# Altium schematic sheet ECU_Sheet.SchDoc
size 420 x 297 mm; SheetNumber: 1; SheetTotal: 4
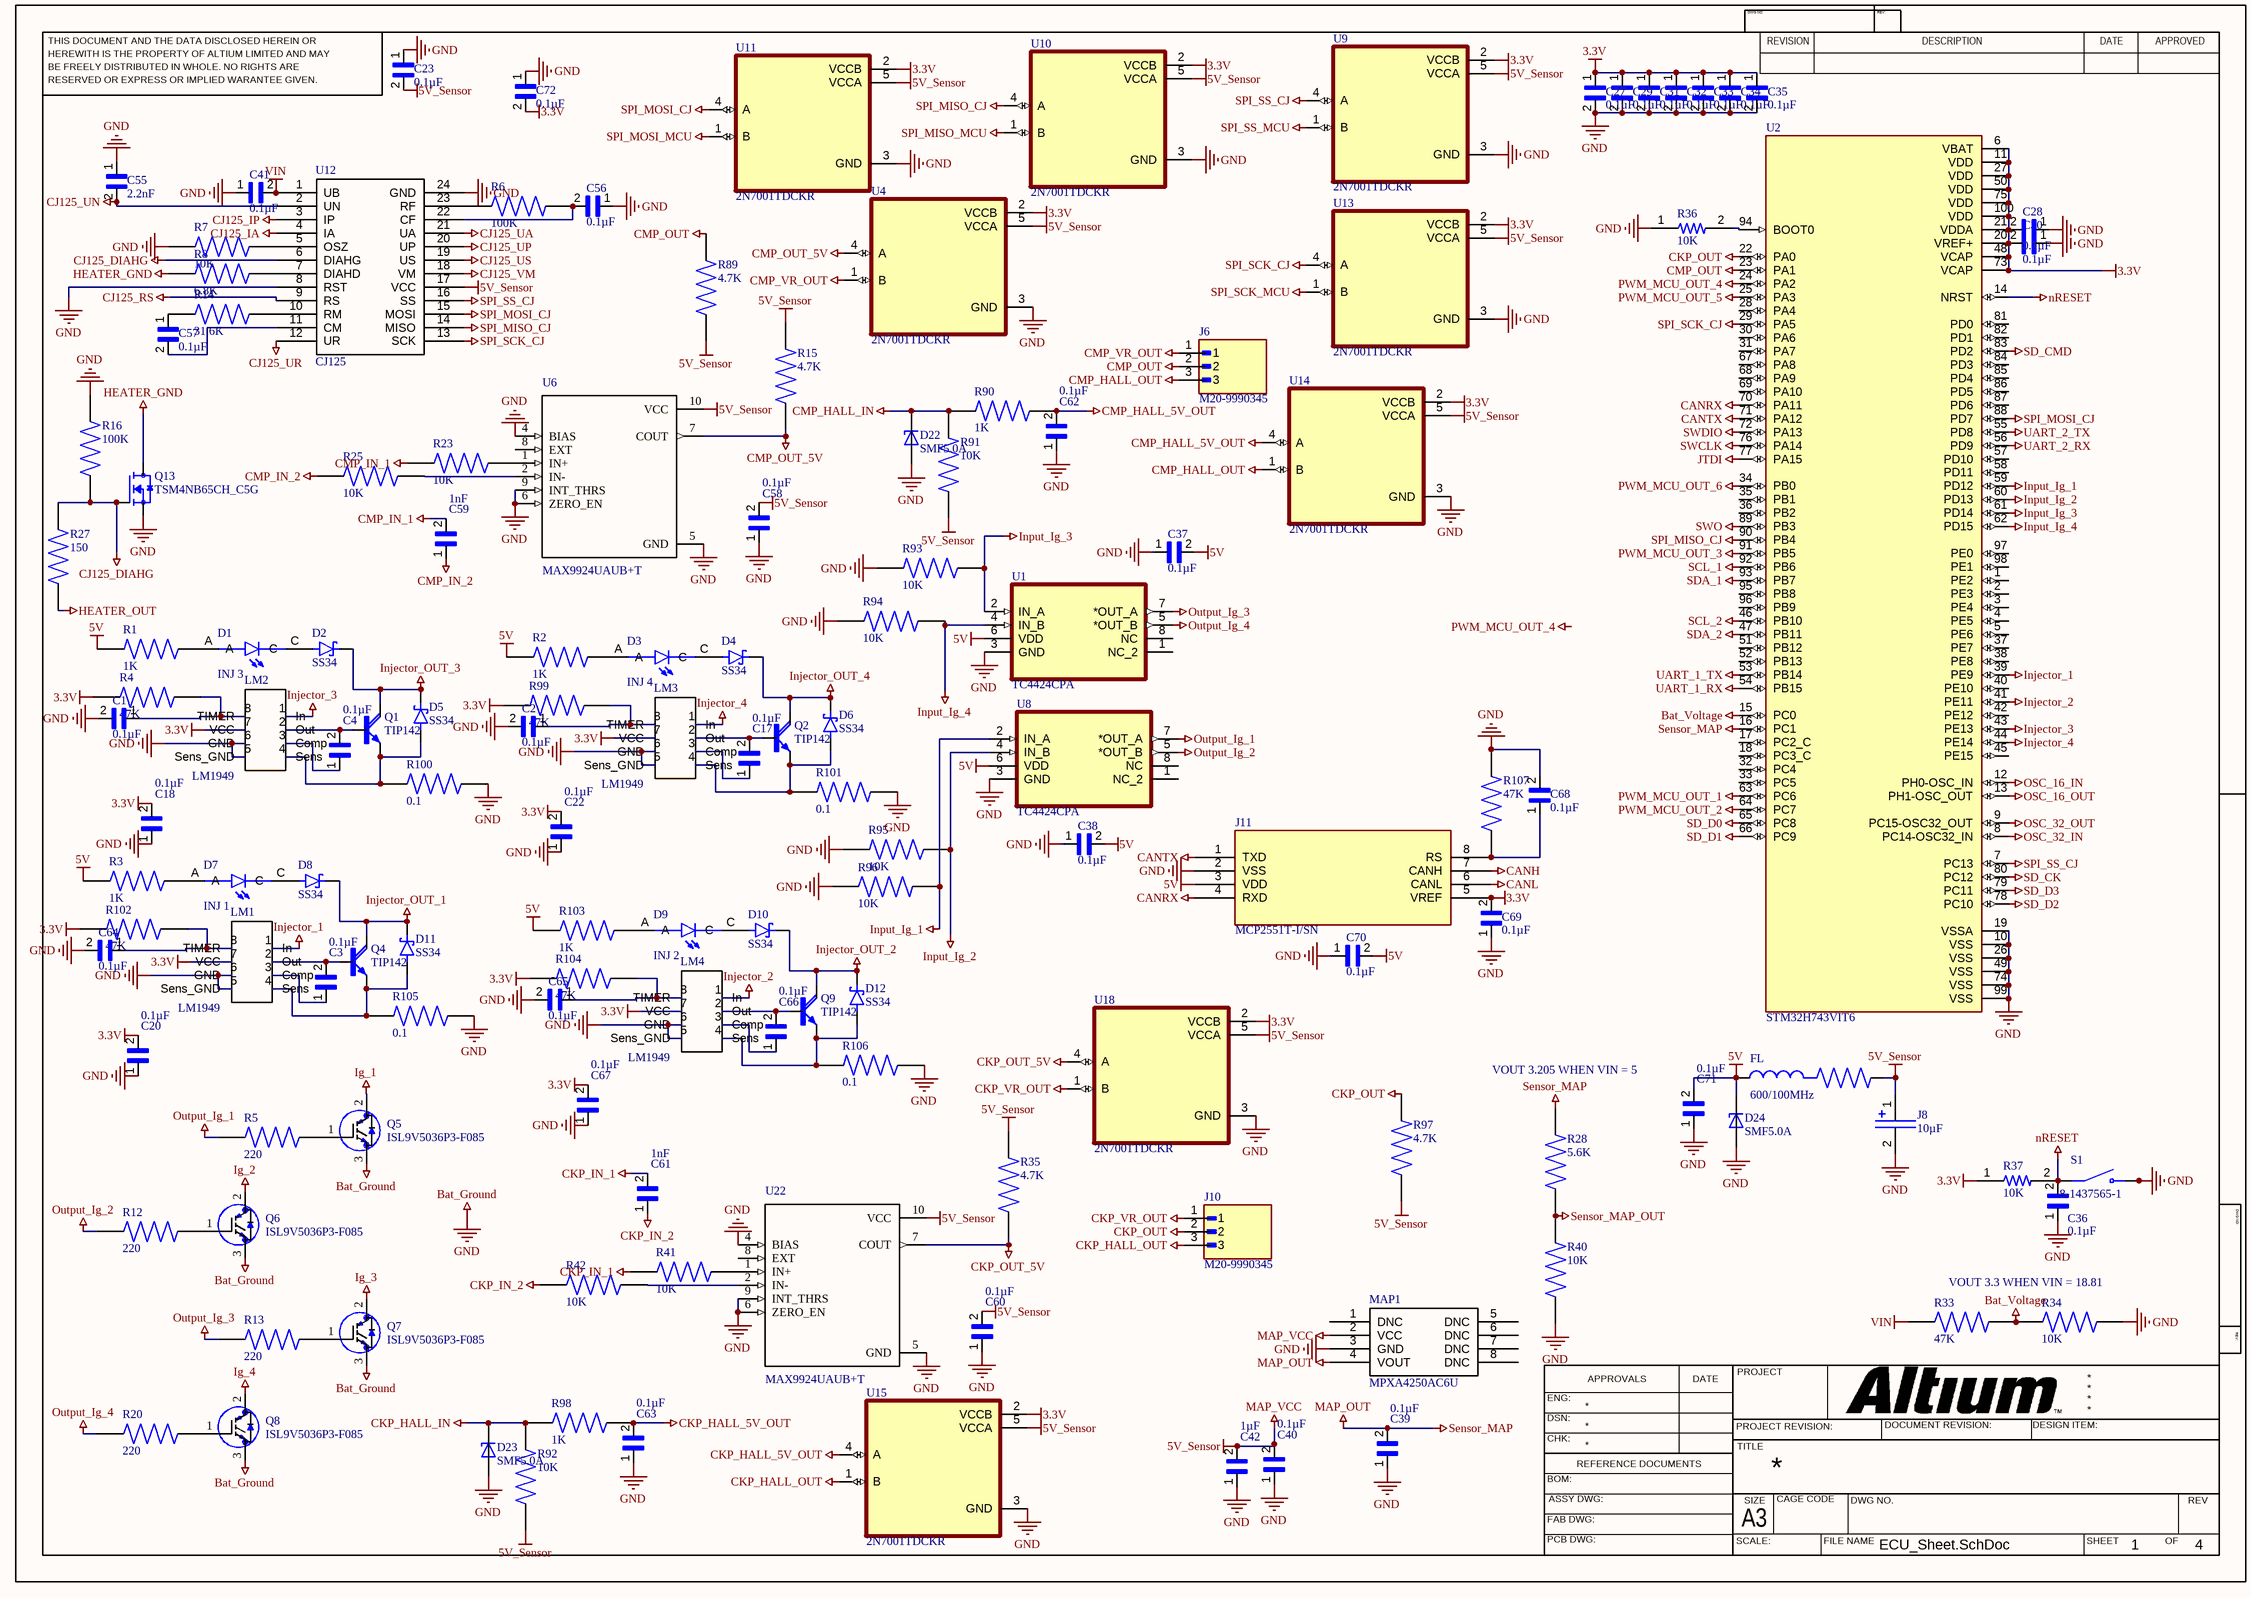
[diagram p0: ECU_Sheet.SchDoc]

## Parts
C1  0.1µF  [CAPC1608X90N]
C2  0.1µF  [CAPC1608X90N]
C3  0.1µF  [CAPC1608X90N]
C4  0.1µF  [CAPC1608X90N]
C17  0.1µF  [CAPC1608X90N]
C18  0.1µF  [CAPC1608X90N]
C20  0.1µF  [CAPC1608X90N]
C22  0.1µF  [CAPC1608X90N]
C23  0.1µF  [CAPC1608X90N]
C27  0.1µF  [CAPC1608X90N]
C28  0.1µF  [CAPC1608X90N]
C29  0.1µF  [CAPC1608X90N]
C30  0.1µF  [CAPC1608X90N]
C31  0.1µF  [CAPC1608X90N]
C32  0.1µF  [CAPC1608X90N]
C33  0.1µF  [CAPC1608X90N]
C34  0.1µF  [CAPC1608X90N]
C35  0.1µF  [CAPC1608X90N]
C36  0.1µF  [CAPC1608X90N]
C37  0.1µF  [CAPC1608X90N]
C38  0.1µF  [CAPC1608X90N]
C39  0.1µF  [CAPC1608X90N]
C40  0.1µF  [CAPC1608X90N]
C41  0.1µF  [CAPC1608X90N]
C42  1µF  [CAPC1608X90N]
C55  2.2nF  [CAPC1608X90N]
C56  0.1µF  [CAPC1608X90N]
C57  0.1µF  [CAPC1608X90N]
C58  0.1µF  [CAPC1608X90N]
C59  1nF  [CAPC1608X90N]
C60  0.1µF  [CAPC1608X90N]
C61  1nF  [CAPC1608X90N]
C62  0.1µF  [CAPC1608X90N]
C63  0.1µF  [CAPC1608X90N]
C64  0.1µF  [CAPC1608X90N]
C65  0.1µF  [CAPC1608X90N]
C66  0.1µF  [CAPC1608X90N]
C67  0.1µF  [CAPC1608X90N]
C68  0.1µF  [CAPC1608X90N]
C69  0.1µF  [CAPC1608X90N]
C70  0.1µF  [CAPC1608X90N]
C71  0.1µF  [CAPC1608X90N]
C72  0.1µF  [CAPC1608X90N]
D1  INJ 3  [LEDC2012X70N]
D2  SS34  [DIO_SS34]
D3  INJ 4  [LEDC2012X70N]
D4  SS34  [DIO_SS34]
D5  SS34  [DIO_SS34]
D6  SS34  [DIO_SS34]
D7  INJ 1  [LEDC2012X70N]
D8  SS34  [DIO_SS34]
D9  INJ 2  [LEDC2012X70N]
D10  SS34  [DIO_SS34]
D11  SS34  [DIO_SS34]
D12  SS34  [DIO_SS34]
D22  SMF5.0A  [SODFL3718X102N]
D23  SMF5.0A  [SODFL3718X102N]
D24  SMF5.0A  [SODFL3718X102N]
FL  600/100MHz  [BEADC1608X95N]
J6  M20-9990345  [HARWIN_M20-9990345]
J8  10µF  [T491A106K010AT]
J10  M20-9990345  [HARWIN_M20-9990345]
J11  MCP2551T-I/SN  [SOIC8-N_MC]
LM1  LM1949  [DIP794W45P254L959H508Q8]
LM2  LM1949  [DIP794W45P254L959H508Q8]
LM3  LM1949  [DIP794W45P254L959H508Q8]
LM4  LM1949  [DIP794W45P254L959H508Q8]
MAP1  MPXA4250AC6U  [SOIC127P1041X990-8N]
Q1  TIP142  [SOT93]
Q2  TIP142  [SOT93]
Q4  TIP142  [SOT93]
Q5  ISL9V5036P3-F085  [*TO254P470X1016X2019-3P]
Q6  ISL9V5036P3-F085  [*TO254P470X1016X2019-3P]
Q7  ISL9V5036P3-F085  [*TO254P470X1016X2019-3P]
Q8  ISL9V5036P3-F085  [*TO254P470X1016X2019-3P]
Q9  TIP142  [SOT93]
Q13  TSM4NB65CH_C5G  [TO228P680X240X837-3]
R1  1K  [RESC3116X65N]
R2  1K  [RESC3116X65N]
R3  1K  [RESC3116X65N]
R4  47K  [RESC3116X65N]
R5  220  [RES_ERJP08J221V]
R6  100K  [RESC3116X65N]
R7  10K  [RESC3116X65N]
R8  6.8K  [RESC3116X65N]
R12  220  [RES_ERJP08J221V]
R13  220  [RES_ERJP08J221V]
R14  31.6K  [RESC3116X65N]
R15  4.7K  [RESC3116X65N]
R16  100K  [RESC3116X65N]
R20  220  [RES_ERJP08J221V]
R23  10K  [RESC3116X65N]
R25  10K  [RESC3116X65N]
R27  150  [RESC3116X65N]
R28  5.6K  [RESC3116X65N]
R33  47K  [RESC3116X65N]
R34  10K  [RESC3116X65N]
R35  4.7K  [RESC3116X65N]
R36  10K  [RESC1608X50N]
R37  10K  [RESC1608X50N]
R40  10K  [RESC3116X65N]
R41  10K  [RESC3116X65N]
R42  10K  [RESC3116X65N]
R89  4.7K  [RESC3116X65N]
R90  1K  [RESC3116X65N]
R91  10K  [RESC3116X65N]
R92  10K  [RESC3116X65N]
R93  10K  [RESC3116X65N]
R94  10K  [RESC3116X65N]
R95  10K  [RESC3116X65N]
R96  10K  [RESC3116X65N]
R97  4.7K  [RESC3116X65N]
R98  1K  [RESC3116X65N]
R99  47K  [RESC3116X65N]
R100  0.1  [RES_ERJ6RSFR10V]
R101  0.1  [RES_ERJ6RSFR10V]
R102  47K  [RESC3116X65N]
R103  1K  [RESC3116X65N]
R104  47K  [RESC3116X65N]
R105  0.1  [RES_ERJ6RSFR10V]
R106  0.1  [RES_ERJ6RSFR10V]
R107  47K  [RESC3116X65N]
S1  8-1437565-1  [SW_8-1437565-1]
U1  TC4424CPA  [DIP254P762X432-8]
U2  STM32H743VIT6  [QFP50P1600X1600X160-100N]
U4  2N7001TDCKR  [SOT65P210X110-5N]
U6  MAX9924UAUB+T  [*SOP50P490X110-10N]
U8  TC4424CPA  [DIP254P762X432-8]
U9  2N7001TDCKR  [SOT65P210X110-5N]
U10  2N7001TDCKR  [SOT65P210X110-5N]
U11  2N7001TDCKR  [SOT65P210X110-5N]
U12  CJ125  [CJ125]
U13  2N7001TDCKR  [SOT65P210X110-5N]
U14  2N7001TDCKR  [SOT65P210X110-5N]
U15  2N7001TDCKR  [SOT65P210X110-5N]
U18  2N7001TDCKR  [SOT65P210X110-5N]
U22  MAX9924UAUB+T  [*SOP50P490X110-10N]

## Nets
3.3V: C18.2 C20.2 C22.2 C27.1 C28.2 C29.1 C30.2 C31.1 C32.1 C33.1 C34.1 C35.1 C67.2 C69.2 C72.2 J11.5(VREF) LM1.7(VCC) LM2.7(VCC) LM3.7(VCC) LM4.7(VCC) R4.1 R37.1 R99.1 R102.1 R104.1 U2.6(VBAT) U2.11(VDD) U2.20(VREF+) U2.21(VDDA) U2.27(VDD) U2.48(VCAP) U2.50(VDD) U2.73(VCAP) U2.75(VDD) U2.100(VDD) U4.2(VCCB) U9.2(VCCB) U10.2(VCCB) U11.2(VCCB) U13.2(VCCB) U14.2(VCCB) U15.2(VCCB) U18.2(VCCB)
5V: C37.2 C38.2 C70.2 C71.2 D24.C FL.1 J11.3(VDD) R1.1 R2.1 R3.1 R103.1 U1.6(VDD) U8.6(VDD)
5V_Sensor: C23.2 C40.2 C42.2 C58.2 C60.2 FL.2 J8.1(P$1) MAP1.2(VCC) R15.2 R35.2 R89.1 R91.1 R92.1 R97.1 U4.5(VCCA) U6.10(VCC) U9.5(VCCA) U10.5(VCCA) U11.5(VCCA) U12.17(VCC) U13.5(VCCA) U14.5(VCCA) U15.5(VCCA) U18.5(VCCA) U22.10(VCC)  [also labelled MAP_VCC]
Bat_Ground: C1.2 C2.2 C18.1 C20.1 C22.1 C23.1 C27.2 C28.1 C29.2 C30.1 C31.2 C32.2 C33.2 C34.2 C35.2 C36.1 C37.1 C38.1 C39.1 C40.1 C41.1 C42.1 C55.1 C56.1 C58.1 C60.1 C62.1 C63.1 C64.2 C65.2 C67.1 C68.2 C69.1 C70.1 C71.1 C72.1 D22.A D23.A D24.A J8.2(P$2) J11.2(VSS) LM1.5(Sens_GND) LM1.6(GND) LM2.5(Sens_GND) LM2.6(GND) LM3.5(Sens_GND) LM3.6(GND) LM4.5(Sens_GND) LM4.6(GND) MAP1.3(GND) Q5.3(E) Q6.3(E) Q7.3(E) Q8.3(E) Q13.3(S) R7.1 R16.2 R34.2 R36.1 R40.1 R93.1 R94.1 R95.1 R96.1 R100.2 R101.2 R105.2 R106.2 R107.2 S1.3(NO) S1.4(NO) U1.3(GND) U2.10(VSS) U2.19(VSSA) U2.26(VSS) U2.49(VSS) U2.74(VSS) U2.99(VSS) U4.3(GND) U6.4(BIAS) U6.5(GND) U6.6(ZERO_EN) U6.9(INT_THRS) U8.3(GND) U9.3(GND) U10.3(GND) U11.3(GND) U12.8(RST) U12.24(GND) U13.3(GND) U14.3(GND) U15.3(GND) U18.3(GND) U22.4(BIAS) U22.5(GND) U22.6(ZERO_EN) U22.9(INT_THRS)  [also labelled GND]
Bat_Voltage: R33.2 R34.1 U2.15(PC0)
CANH: J11.7(CANH)
CANL: J11.6(CANL)
CANRX: J11.4(RXD) U2.70(PA11)
CANTX: J11.1(TXD) U2.71(PA12)
CJ125_DIAHG: Q13.1(G) R16.1 R27.2 U12.6(DIAHG)
CJ125_IA: U12.4(IA)
CJ125_IP: U12.3(IP)
CJ125_RS: U12.9(RS)
CJ125_UA: U12.21(UA)
CJ125_UN: C55.2 U12.2(UN)
CJ125_UP: U12.20(UP)
CJ125_UR: U12.12(UR)
CJ125_US: U12.19(US)
CJ125_VM: U12.18(VM)
CKP_HALL_5V_OUT: C63.2 R98.1 U15.4(A)
CKP_HALL_IN: D23.C R92.2 R98.2
CKP_HALL_OUT: J10.3 U15.1(B)
CKP_IN_1: C61.2 R41.1
CKP_IN_2: C61.1 R42.1
CKP_OUT: J10.2 R97.2 U2.22(PA0)
CKP_OUT_5V: R35.1 U18.4(A) U22.7(COUT)
CKP_VR_OUT: J10.1 U18.1(B)
CMP_HALL_5V_OUT: C62.2 R90.1 U14.4(A)
CMP_HALL_IN: D22.C R90.2 R91.2
CMP_HALL_OUT: J6.3 U14.1(B)
CMP_IN_1: C59.2 R23.1
CMP_IN_2: C59.1 R25.1
CMP_OUT: J6.2 R89.2 U2.23(PA1)
CMP_OUT_5V: R15.1 U4.4(A) U6.7(COUT)
CMP_VR_OUT: J6.1 U4.1(B)
HEATER_GND: Q13.2(D) R8.1
HEATER_OUT: R27.1
Ig_1: Q5.2(C)
Ig_2: Q6.2(C)
Ig_3: Q7.2(C)
Ig_4: Q8.2(C)
Injector_1: LM1.1(In) U2.39(PE9)
Injector_2: LM4.1(In) U2.41(PE11)
Injector_3: LM2.1(In) U2.43(PE13)
Injector_4: LM3.1(In) U2.44(PE14)
Injector_OUT_1: D8.C(K) D11.C(K) Q4.C
Injector_OUT_2: D10.C(K) D12.C(K) Q9.C
Injector_OUT_3: D2.C(K) D5.C(K) Q1.C
Injector_OUT_4: D4.C(K) D6.C(K) Q2.C
Input_Ig_1: R96.2 U2.59(PD12) U8.2(IN_A)
Input_Ig_2: R95.2 U2.60(PD13) U8.4(IN_B)
Input_Ig_3: R93.2 U1.2(IN_A) U2.61(PD14)
Input_Ig_4: R94.2 U1.4(IN_B) U2.62(PD15)
JTDI: U2.77(PA15)
MAP_OUT: C39.2 MAP1.4(VOUT) R28.1 U2.16(PC1)  [also labelled Sensor_MAP]
nRESET: C36.2 R37.2 S1.1(COM) S1.2(COM) U2.14(NRST)
OSC_16_IN: U2.12(PH0-OSC_IN)
OSC_16_OUT: U2.13(PH1-OSC_OUT)
OSC_32_IN: U2.8(PC14-OSC32_IN)
OSC_32_OUT: U2.9(PC15-OSC32_OUT)
Output_Ig_1: R5.1 U8.7(*OUT_A)
Output_Ig_2: R12.1 U8.5(*OUT_B)
Output_Ig_3: R13.1 U1.7(*OUT_A)
Output_Ig_4: R20.1 U1.5(*OUT_B)
PWM_MCU_OUT_1: U2.63(PC6)
PWM_MCU_OUT_2: U2.64(PC7)
PWM_MCU_OUT_3: U2.91(PB5)
PWM_MCU_OUT_4: U2.24(PA2)
PWM_MCU_OUT_5: U2.25(PA3)
PWM_MCU_OUT_6: U2.34(PB0)
SCL_1: U2.92(PB6)
SCL_2: U2.46(PB10)
SD_CK: U2.80(PC12)
SD_CMD: U2.83(PD2)
SD_D0: U2.65(PC8)
SD_D1: U2.66(PC9)
SD_D2: U2.78(PC10)
SD_D3: U2.79(PC11)
SDA_1: U2.93(PB7)
SDA_2: U2.47(PB11)
Sensor_MAP_OUT: R28.2 R40.2
SPI_MISO_CJ: U2.90(PB4) U10.4(A) U12.14(MISO)
SPI_MISO_MCU: U10.1(B)
SPI_MOSI_CJ: U2.88(PD7) U11.4(A) U12.15(MOSI)
SPI_MOSI_MCU: U11.1(B)
SPI_SCK_CJ: U2.29(PA5) U12.13(SCK) U13.4(A)
SPI_SCK_MCU: U13.1(B)
SPI_SS_CJ: U2.7(PC13) U9.4(A) U12.16(SS)
SPI_SS_MCU: U9.1(B)
SWCLK: U2.76(PA14)
SWDIO: U2.72(PA13)
SWO: U2.89(PB3)
UART_1_RX: U2.54(PB15)
UART_1_TX: U2.53(PB14)
UART_2_RX: U2.56(PD9)
UART_2_TX: U2.55(PD8)
VIN: C41.2 R33.1 U12.1(UB)
NetC1_1: C1.1 LM2.8(TIMER) R4.2
NetC2_1: C2.1 LM3.8(TIMER) R99.2
NetC3_1: C3.1 LM1.3(Comp)
NetC3_2: C3.2 LM1.2(Out) Q4.B
NetC4_1: C4.1 LM2.3(Comp)
NetC4_2: C4.2 LM2.2(Out) Q1.B
NetC17_1: C17.1 LM3.3(Comp)
NetC17_2: C17.2 LM3.2(Out) Q2.B
NetC56_2: C56.2 R6.2 U12.22(CF)
NetC57_1: C57.1 R14.1
NetC57_2: C57.2 U12.11(CM)
NetC64_1: C64.1 LM1.8(TIMER) R102.2
NetC65_1: C65.1 LM4.8(TIMER) R104.2
NetC66_1: C66.1 LM4.3(Comp)
NetC66_2: C66.2 LM4.2(Out) Q9.B
NetC68_1: C68.1 J11.8(RS) R107.1
NetD1_A: D1.A R1.2
NetD1_C: D1.C D2.A
NetD3_A: D3.A R2.2
NetD3_C: D3.C D4.A
NetD5_A: D5.A LM2.4(Sens) Q1.E R100.1
NetD6_A: D6.A LM3.4(Sens) Q2.E R101.1
NetD7_A: D7.A R3.2
NetD7_C: D7.C D8.A
NetD9_A: D9.A R103.2
NetD9_C: D9.C D10.A
NetD11_A: D11.A LM1.4(Sens) Q4.E R105.1
NetD12_A: D12.A LM4.4(Sens) Q9.E R106.1
NetQ5_1: Q5.1(G) R5.2
NetQ6_1: Q6.1(G) R12.2
NetQ7_1: Q7.1(G) R13.2
NetQ8_1: Q8.1(G) R20.2
NetR6_1: R6.1 U12.23(RF)
NetR7_2: R7.2 U12.5(OSZ)
NetR8_2: R8.2 U12.7(DIAHD)
NetR14_2: R14.2 U12.10(RM)
NetR23_2: R23.2 U6.1(IN+)
NetR25_2: R25.2 U6.2(IN-)
NetR36_2: R36.2 U2.94(BOOT0)
NetR41_2: R41.2 U22.1(IN+)
NetR42_2: R42.2 U22.2(IN-)

Not connected (* = marked no-connect by the designer): MAP1 1(DNC) 5(DNC) 6(DNC) 7(DNC) 8(DNC); U1 1(NC_2) 8(NC); U2 1(PE2) 2(PE3) 3(PE4) 4(PE5) 5(PE6) 17(PC2_C) 18(PC3_C) 28(PA4) 30(PA6) 31(PA7) 32(PC4) 33(PC5) 35(PB1) 36(PB2) 37(PE7) 38(PE8) 40(PE10) 42(PE12) 45(PE15) 51(PB12) 52(PB13) 57(PD10) 58(PD11) 67(PA8) 68(PA9) 69(PA10) 81(PD0) 82(PD1) 84(PD3) 85(PD4) 86(PD5) 87(PD6) 95(PB8) 96(PB9) 97(PE0) 98(PE1); U6 8(EXT); U8 1(NC_2) 8(NC); U22 8(EXT)

## Notes on the sheet
- VOUT 3.205 WHEN VIN = 5
- VOUT 3.3 WHEN VIN = 18.81
- Labels drawn without touching a wire or pin: PWM_MCU_OUT_4
- THIS DOCUMENT AND THE DATA DISCLOSED HEREIN OR
- HEREWITH IS THE PROPERTY OF ALTIUM LIMITED AND MAY
- DWG NO:
- REVISION
- REV:
- DESCRIPTION
- DATE
- APPROVED
- BE FREELY DISTRIBUTED IN WHOLE. NO RIGHTS ARE
- RESERVED OR EXPRESS OR IMPLIED WARANTEE GIVEN.
- ENG:
- APPROVALS
- PROJECT
- DSN:
- CHK:
- REFERENCE DOCUMENTS
- PROJECT REVISION:
- TITLE
- DOCUMENT REVISION:
- DESIGN ITEM:
- BOM:
- FAB DWG:
- PCB DWG:
- ASSY DWG:
- SCALE:
- A3
- SIZE
- CAGE CODE
- FILE NAME
- DWG NO.
- SHEET
- OF
- REV

## Library data of the parts
C1-C4 C17 C18 C20 C22 C23 C27-C42 C55-C72 = 06035C104MAZ2A: Multilayer Ceramic Capacitors MLCC - SMD/SMT; Package: None; Price: None; Value: *; MP: 06035C104MAZ2A; Availability: Unavailable
D1 D3 D7 D9 = 597-3305-607F: LED Uni-Color Green 4-Pin Chip 0805 T/R; Availability: Unavailable; Value: *; Price: None; MP: 597-3305-607F; Package: None
D2 D4-D6 D8 D10-D12 = SS34: 3A, 40V, Schottky Rectifier; MF: Taiwan Semiconductor; SnapEDA_Link: https://www.snapeda.com/parts/SS34/Taiwan+Semiconductor/view-part/?ref=snap; Package: DO-214AB-2 Taiwan Semiconductor; Value: *; MP: SS34; Check_prices: https://www.snapeda.com/parts/SS34/Taiwan+Semiconductor/view-part/?ref=eda
D22-D24 = SMF5.0A: 200W, 6.7V, 5%, Unidirectional, TVS; MF: Taiwan Semiconductor; SnapEDA_Link: https://www.snapeda.com/parts/SMF5.0A/taiwan/view-part/?ref=snap; Package: SOD-123W-2 Taiwan Semiconductor; Value: *; MP: SMF5.0A; Check_prices: https://www.snapeda.com/parts/SMF5.0A/taiwan/view-part/?ref=eda
FL = BLM18DN601SZ1D: 600 Ohms @ 100MHz 1 Ferrite Bead 0603 _1608 Metric_ 700mA; MF: Murata; Package: 1608 Murata; Availability: Unavailable; Value: *; MP: BLM18DN601SZ1D; SnapEDA_Link: https://www.snapeda.com/parts/BLM18DN601SZ1D/Murata/view-part/4302620/?ref=snap; Price: None
J6 J10 = M20-9990345: 2.54mm (0.1) Pitch SIL Vertical Throughboard Pin Header, 6.1mm mating pin height, gold (hi-temp mould), 3 contacts; MF: Harwin; SnapEDA_Link: https://www.snapeda.com/parts/M20-9990345/Harwin+Inc./view-part/?ref=snap; Package: None; Value: *; MP: M20-9990345; Check_prices: https://www.snapeda.com/parts/M20-9990345/Harwin+Inc./view-part/?ref=eda
J8 = T491A106K010AT: Condensador electrolÃ­tico de tantalio sÃ³lido MnO2 de 10 ÂµF, 10 V CC +/-10 %, serie T491 ¦ KEMET T491A106K010AT; SnapEDA_Link: https://www.snapeda.com/parts/T491A106K010AT/KEMET/view-part/?ref=snap; Package: SMD-2 KEMET; Value: *; MF: KEMET; MP: T491A106K010AT; Check_prices: https://www.snapeda.com/parts/T491A106K010AT/KEMET/view-part/?ref=eda
J11 = MCP2551T-I/SN: Microchip MCP2551T-I/SN, CAN Transceiver 1Mbit/s 1-channel ISO 11898, 8-Pin SOIC | Microchip Technology Inc. MCP2551T-I/SN; SnapEDA_Link: https://www.snapeda.com/parts/MCP2551T-I/SN/Microchip/view-part/?ref=snap; Package: SO-8 Microchip; Value: *; MF: Microchip; MP: MCP2551T-I/SN; Check_prices: https://www.snapeda.com/parts/MCP2551T-I/SN/Microchip/view-part/?ref=eda
LM1-LM4 = Component_1
Q1 Q2 Q4 Q9 = TIP142: Bipolar (BJT) Transistor NPN - Darlington 100 V 10 A - 125 W Through Hole TO-247-3; MF: ON Semiconductor; SnapEDA_Link: https://www.snapeda.com/parts/TIP142/Onsemi/view-part/?ref=snap; Package: SOT-93-3 ON Semiconductor; Value: *; MP: TIP142; Check_prices: https://www.snapeda.com/parts/TIP142/Onsemi/view-part/?ref=eda
Q13 = TSM4NB65CH_C5G: 650V, 4A, Single N-Channel Power MOSFET; MF: Taiwan Semiconductor; MP: TSM4NB65CH C5G; SnapEDA_Link: https://www.snapeda.com/parts/TSM4NB65CH%20C5G/Taiwan+Semiconductor/view-part/?ref=snap; Package: TO-251 Taiwan Semiconductor; Value: *; Check_prices: https://www.snapeda.com/parts/TSM4NB65CH%20C5G/Taiwan+Semiconductor/view-part/?ref=eda
R1-R3 R103 = RC1206JR-071KL: RES, THICK FILM, 1K, 5%, 0.25W, 1206; Resistance:1kohm; Resistance Tolerance:Â± 5%; Power Rating:250mW; Resistor Case Style:1206 ^3216 Metric]; Resistor Technology:Thick Film; Resistor Type:General Purpose; Product Range:RC Series; MF: Yageo Corporation; MP: RC1206JR071KL; SnapEDA_Link: https://www.snapeda.com/parts/RC1206JR071KL/Yageo/view-part/?ref=snap; Package: 1206-2 YAGEO; Value: *; Check_prices: https://www.snapeda.com/parts/RC1206JR071KL/Yageo/view-part/?ref=eda
R4 R6-R8 R14-R16 R23 R25 R27 R28 R33-R35 R40-R42 R89-R99 R102 R104 R107 = AA1206JR-07470RL: Package: None; Price: None; Value: *; MP: AA1206JR-07470RL; Availability: Unavailable
R5 R12 R13 R20 = ERJP08J221V: Value: *; Price: None; Availability: Unavailable; Package: None; MP: ERJP08J221V
R36 R37 = RP73PF1J10KBTDF: Thin Film Resistors - SMD 10K OHM .1% 25PPM; Voltage_Rating: 75 V; Power_Rating: .166 W; MF: TE Connectivity; Mouser-Purchase-URL: https://snapeda.com/shop?store=Mouser&id=550687; Value: *; SnapEDA_Link: https://www.snapeda.com/parts/RP73PF1J10KBTDF/TE%20Connectivity%20Passive%20Product/view-part/550687/?ref=snap; MP: RP73PF1J10KBTDF; Tolerance: .1%; Digi-Key_Part_Number: A110204CT-ND; Resistance: 10K; Package: 0603
R100 R101 R105 R106 = ERJ6RSFR10V: Availability: Unavailable; MP: ERJ6RSFR10V; Price: None; Package: None; Value: *
U1 U8 = TC4424CPA: Dual MOSFET Power Driver 3A 4.5 to 18V Non-Inverting 8-Pin PDIP | Microchip Technology Inc. TC4424CPA; SnapEDA_Link: https://www.snapeda.com/parts/TC4424CPA/Microchip/view-part/?ref=snap; Package: DIP-8 Microchip; Value: *; MF: Microchip; MP: TC4424CPA; Check_prices: https://www.snapeda.com/parts/TC4424CPA/Microchip/view-part/?ref=eda
U2 = STM32H743VIT6: ARMÂ® CortexÂ®-M7 STM32H7 Microcontroller IC 32-Bit Single-Core 480MHz 2MB (2M x 8) FLASH 100-LQFP (14x14); MF: STMicroelectronics; SnapEDA_Link: https://www.snapeda.com/parts/STM32H743VIT6/STMicroelectronics/view-part/?ref=snap; Package: LQFP-100 STMicroelectronics; Value: *; MP: STM32H743VIT6; Check_prices: https://www.snapeda.com/parts/STM32H743VIT6/STMicroelectronics/view-part/?ref=eda
U4 U9-U11 U13-U15 U18 = 2N7001TDCKR: 1-bit dual-supply buffered voltage signal converter; MF: Texas Instruments; SnapEDA_Link: https://www.snapeda.com/parts/2N7001TDCKR/Texas+Instruments/view-part/?ref=snap; Package: SC70-5 Texas Instruments; Value: *; MP: 2N7001TDCKR; Check_prices: https://www.snapeda.com/parts/2N7001TDCKR/Texas+Instruments/view-part/?ref=eda
Q5-Q8 = ISL9V5036P3-F085: SnapEDA_Link: https://www.snapeda.com/parts/ISL9V5036P3-F085/Onsemi/view-part/?ref=snap; Check_prices: https://www.snapeda.com/parts/ISL9V5036P3-F085/Onsemi/view-part/?ref=eda; Value: *
S1 = 8-1437565-1: Package: None; MP: 8-1437565-1; Price: None; Availability: Unavailable; Value: *
U6 U22 = MAX9924UAUB+T: SnapEDA_Link: https://www.snapeda.com/parts/MAX9924UAUB+T/Maxim+Integrated/view-part/?ref=snap; Check_prices: https://www.snapeda.com/parts/MAX9924UAUB+T/Maxim+Integrated/view-part/?ref=eda; Value: *